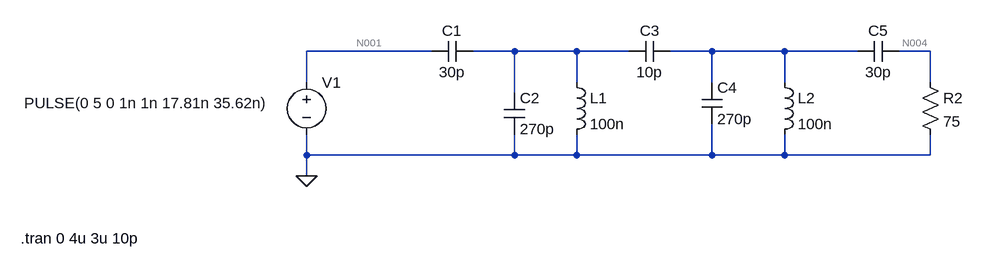
[diagram p0: schematic 10m_from_pi_filter_amp.asc]
10m_from_pi_filter_amp.asc, the LTspice schematic file:
Version 4
SHEET 1 984 680
WIRE 160 64 -32 64
WIRE 288 64 224 64
WIRE 384 64 288 64
WIRE 464 64 384 64
WIRE 592 64 528 64
WIRE 704 64 592 64
WIRE 816 64 704 64
WIRE 928 64 880 64
WIRE -32 112 -32 64
WIRE 384 112 384 64
WIRE 592 112 592 64
WIRE 704 112 704 64
WIRE 928 112 928 64
WIRE 288 128 288 64
WIRE -32 224 -32 192
WIRE 288 224 288 192
WIRE 288 224 -32 224
WIRE 384 224 384 192
WIRE 384 224 288 224
WIRE 592 224 592 176
WIRE 592 224 384 224
WIRE 704 224 704 192
WIRE 704 224 592 224
WIRE 928 224 928 192
WIRE 928 224 704 224
WIRE -32 256 -32 224
FLAG -32 256 0
SYMBOL cap 224 48 R90
WINDOW 0 0 32 VBottom 2
WINDOW 3 32 32 VTop 2
SYMATTR InstName C1
SYMATTR Value 30p
SYMBOL cap 272 128 R0
SYMATTR InstName C2
SYMATTR Value 270p
SYMBOL ind 368 96 R0
SYMATTR InstName L1
SYMATTR Value 100n
SYMBOL cap 528 48 R90
WINDOW 0 0 32 VBottom 2
WINDOW 3 32 32 VTop 2
SYMATTR InstName C3
SYMATTR Value 10p
SYMBOL cap 576 112 R0
SYMATTR InstName C4
SYMATTR Value 270p
SYMBOL ind 688 96 R0
SYMATTR InstName L2
SYMATTR Value 100n
SYMBOL cap 880 48 R90
WINDOW 0 0 32 VBottom 2
WINDOW 3 32 32 VTop 2
SYMATTR InstName C5
SYMATTR Value 30p
SYMBOL res 912 96 R0
SYMATTR InstName R2
SYMATTR Value 75
SYMBOL voltage -32 96 R0
WINDOW 3 -435 48 Left 2
WINDOW 123 0 0 Left 0
WINDOW 39 0 0 Left 0
SYMATTR InstName V1
SYMATTR Value PULSE(0 5 0 1n 1n 17.81n 35.62n)
TEXT -472 352 Left 2 !.tran 0 4u 3u 10p

The netlist it stands for:
* 10m_from_pi_filter_amp.asc
C1 N002 N001 30p
C2 N002 0 270p
L1 N002 0 100n
C3 N003 N002 10p
C4 N003 0 270p
L2 N003 0 100n
C5 N004 N003 30p
R2 N004 0 75
V1 N001 0 PULSE(0 5 0 1n 1n 17.81n 35.62n)
.tran 0 4u 3u 10p
.backanno
.end

* Results of the author's LTspice run, read from the files saved beside the schematic
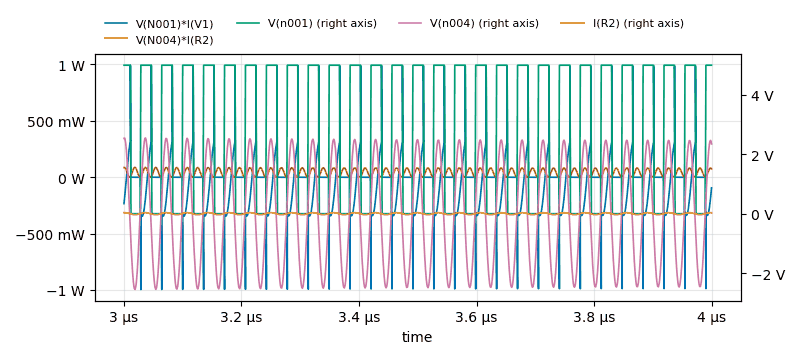
[diagram p1: Transient Analysis of 10m_from_pi_filter_amp.asc, plotted from the saved traces]
* Transient Analysis, 1 run:
*   V(N001)*I(V1): min -996.1 mW, max 993.4 mW, average -41.58 mW, rms 223 mW, last -94.16 mW
*   V(N004)*I(R2): min 0 W, max 86.96 mW, average 41.8 mW, rms 51.12 mW, last 73.58 mW
*   V(n001): min 0 V, max 5 V, average 2.647 V, rms 3.613 V, last 5 V
*   V(n004): min -2.554 V, max 2.553 V, average 6.292 mV, rms 1.77 V, last 2.349 V
*   I(R2): min -34.05 mA, max 34.04 mA, average 83.9 µA, rms 23.61 mA, last 31.32 mA